# EAGLE schematic dat1 (EAGLE 6.1)

## Sheet 1 of 2
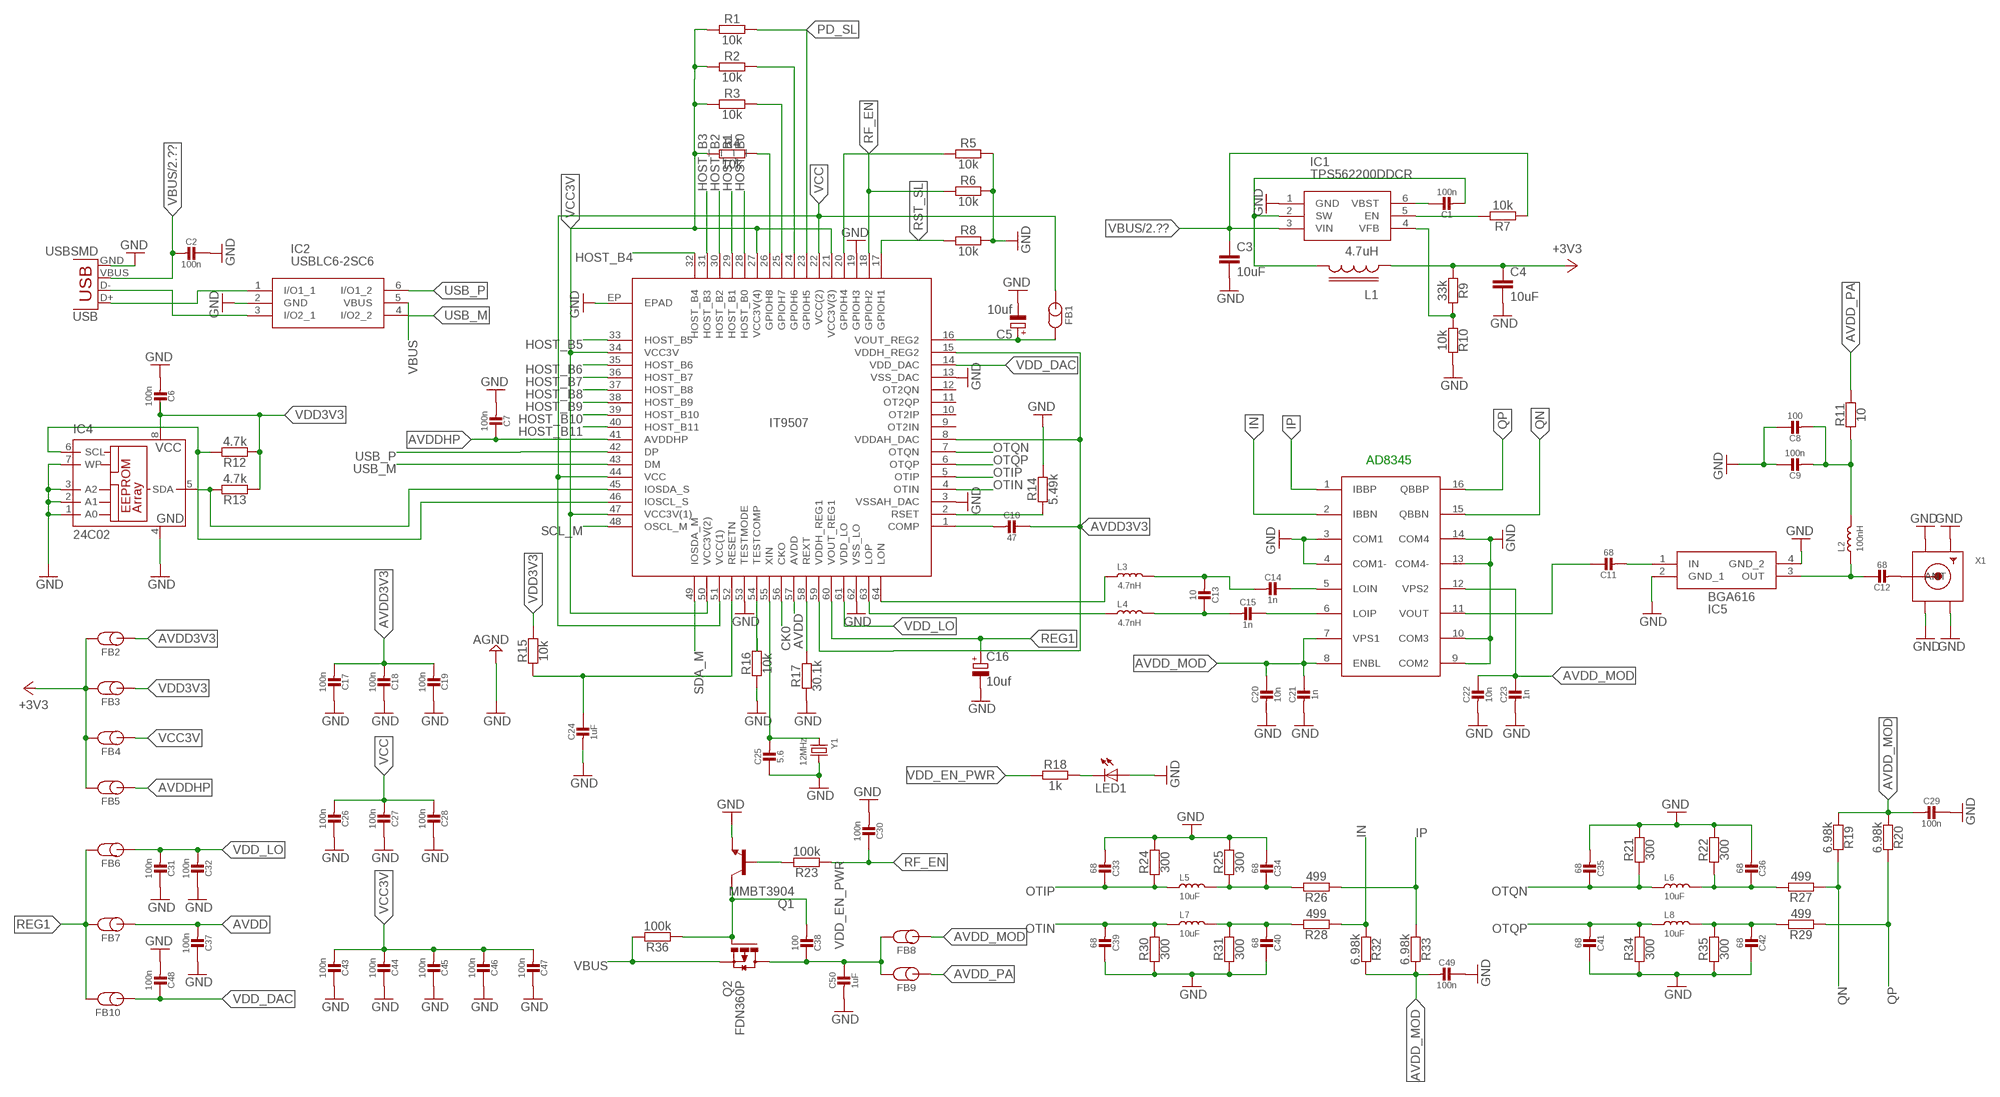
[diagram p0: schematic, sheet 1]

### Parts
C1  100n  CAP_CERAMIC_0402  [_0402]
C2  100n  CAP_CERAMIC_0402  [_0402]
C3  10uF  C-EUC0805K  [C0805K]
C4  10uF  C-EUC0805K  [C0805K]
C5  10uf  CPOL-EUSMCA  [SMC_A]
C6  100n  CAP_CERAMIC_0402  [_0402]
C7  100n  CAP_CERAMIC_0402  [_0402]
C8  100  CAP_CERAMIC_0402  [_0402]
C9  100n  CAP_CERAMIC_0402  [_0402]
C10  47  CAP_CERAMIC_0402  [_0402]
C11  68  CAP_CERAMIC_0402  [_0402]
C12  68  CAP_CERAMIC_0402  [_0402]
C13  10  CAP_CERAMIC_0402  [_0402]
C14  1n  CAP_CERAMIC_0402  [_0402]
C15  1n  CAP_CERAMIC_0402  [_0402]
C16  10uf  CPOL-EUSMCA  [SMC_A]
C17  100n  CAP_CERAMIC_0402  [_0402]
C18  100n  CAP_CERAMIC_0402  [_0402]
C19  100n  CAP_CERAMIC_0402  [_0402]
C20  10n  CAP_CERAMIC_0402  [_0402]
C21  1n  CAP_CERAMIC_0402  [_0402]
C22  10n  CAP_CERAMIC_0402  [_0402]
C23  1n  CAP_CERAMIC_0402  [_0402]
C24  1uF  CAP_CERAMIC_0402  [_0402]
C25  5.6  CAP_CERAMIC_0402  [_0402]
C26  100n  CAP_CERAMIC_0402  [_0402]
C27  100n  CAP_CERAMIC_0402  [_0402]
C28  100n  CAP_CERAMIC_0402  [_0402]
C29  100n  CAP_CERAMIC_0402  [_0402]
C30  100n  CAP_CERAMIC_0402  [_0402]
C31  100n  CAP_CERAMIC_0402  [_0402]
C32  100n  CAP_CERAMIC_0402  [_0402]
C33  68  CAP_CERAMIC_0402  [_0402]
C34  68  CAP_CERAMIC_0402  [_0402]
C35  68  CAP_CERAMIC_0402  [_0402]
C36  68  CAP_CERAMIC_0402  [_0402]
C37  100n  CAP_CERAMIC_0402  [_0402]
C38  100  CAP_CERAMIC_0402  [_0402]
C39  68  CAP_CERAMIC_0402  [_0402]
C40  68  CAP_CERAMIC_0402  [_0402]
C41  68  CAP_CERAMIC_0402  [_0402]
C42  68  CAP_CERAMIC_0402  [_0402]
C43  100n  CAP_CERAMIC_0402  [_0402]
C44  100n  CAP_CERAMIC_0402  [_0402]
C45  100n  CAP_CERAMIC_0402  [_0402]
C46  100n  CAP_CERAMIC_0402  [_0402]
C47  100n  CAP_CERAMIC_0402  [_0402]
C48  100n  CAP_CERAMIC_0402  [_0402]
C49  100n  CAP_CERAMIC_0402  [_0402]
C50  1uF  CAP_CERAMIC_0603  [_0603]
FB1  FB0603  [INDC1608X95N]
FB2  FB0603  [INDC1608X95N]
FB3  FB0603  [INDC1608X95N]
FB4  FB0603  [INDC1608X95N]
FB5  FB0603  [INDC1608X95N]
FB6  FB0603  [INDC1608X95N]
FB7  FB0603  [INDC1608X95N]
FB8  FB0603  [INDC1608X95N]
FB9  FB0603  [INDC1608X95N]
FB10  FB0603  [INDC1608X95N]
IC1  TPS562200DDCR  [SOT95P280X110-6N]
IC2  USBLC6-2SC6  [SOT95P280X145-6N]
IC3  CRYSTALVIDEO_IT9518  [CRYSTALVIDEO_QFN64P40_IT9518]
IC4  24C02  24C01ASN  [SO-08]
IC5  BGA616  [BGA616]
IC6  AD8346  [QSOP16]
L1  4.7uH  L3X3  [L_3X3]
L2  100nH  INDUCTOR/FERRITE-BEAD-0603  [L0603@1]
L3  4.7nH  INDUCTOR/FERRITE-BEAD-0603  [L0603@1]
L4  4.7nH  INDUCTOR/FERRITE-BEAD-0603  [L0603@1]
L5  10uF  INDUCTOR/FERRITE-BEAD-0805  [L0805@1]
L6  10uF  INDUCTOR/FERRITE-BEAD-0805  [L0805@1]
L7  10uF  INDUCTOR/FERRITE-BEAD-0805  [L0805@1]
L8  10uF  INDUCTOR/FERRITE-BEAD-0805  [L0805@1]
LED1  POWER  LEDCHIPLED-0603-TTW  [CHIPLED-0603-TTW]
Q1  MMBT3904  MMBT3904LT1-NPN-SOT23-BEC  [SOT23-BEC]
Q2  FDN360P  [SUPER-SOT3]
R1  10k  RESISTORS-0402  [C0402]
R2  10k  RESISTORS-0402  [C0402]
R3  10k  RESISTORS-0402  [C0402]
R4  10k  RESISTORS-0402  [C0402]
R5  10k  RESISTORS-0402  [C0402]
R6  10k  RESISTORS-0402  [C0402]
R7  10k  RESISTORS-0402  [C0402]
R8  10k  RESISTORS-0402  [C0402]
R9  33k  RESISTORS-0402  [C0402]
R10  10k  RESISTORS-0402  [C0402]
R11  10  RESISTORS-0603  [C0603]
R12  4.7k  RESISTORS-0402  [C0402]
R13  4.7k  RESISTORS-0402  [C0402]
R14  5.49k  RESISTORS-0402  [C0402]
R15  10k  RESISTORS-0402  [C0402]
R16  10k  RESISTORS-0402  [C0402]
R17  30.1k  RESISTORS-0402  [C0402]
R18  1k  RESISTORS-0402  [C0402]
R19  6.98k  RESISTORS-0402  [C0402]
R20  6.98k  RESISTORS-0402  [C0402]
R21  300  RESISTORS-0402  [C0402]
R22  300  RESISTORS-0402  [C0402]
R23  100k  RESISTORS-0603  [C0603]
R24  300  RESISTORS-0402  [C0402]
R25  300  RESISTORS-0402  [C0402]
R26  499  RESISTORS-0402  [C0402]
R27  499  RESISTORS-0402  [C0402]
R28  499  RESISTORS-0402  [C0402]
R29  499  RESISTORS-0402  [C0402]
R30  300  RESISTORS-0402  [C0402]
R31  300  RESISTORS-0402  [C0402]
R32  6.98k  RESISTORS-0402  [C0402]
R33  6.98k  RESISTORS-0402  [C0402]
R34  300  RESISTORS-0402  [C0402]
R35  300  RESISTORS-0402  [C0402]
R36  100k  RESISTORS-0603  [C0603]
USB  USBSMD  [USB-MINIB]
X1  MODULATOR_MICROBUILDER_SMACONNECTOR_EDGE_UFL  [MODULATOR_MICROBUILDER_SMA_EDGELAUNCH_UFL]
Y1  12MHz  CRYSTAL3.2X2.5  [CRYSTAL_3.2X2.5]

### Nets
+3V3: C4.1 FB2.2 FB3.2 FB4.2 FB5.2 L1.1 R9.1
AVDD: C37.2 FB7.1 IC3.57(AVDD)
AVDD3V3: C10.1 C17.2 C18.2 C19.2 FB2.1 IC3.8(VDDAH_DAC) IC3.15(VDDH_REG2) IC3.59(VDDH_REG1)
AVDD_MOD: C20.1 C21.1 C22.1 C23.1 C29.2 C49.2 FB8.1 IC6.7(VPS1) IC6.8(ENBL) IC6.12(VPS2) R19.1 R20.1 R32.2 R33.2
AVDD_PA: FB9.1 R11.2
AVDDHP: C7.1 FB5.1 IC3.41(AVDDHP)
CK0: IC3.56(CKO) ; also sheet 2
GND: C2.1 C3.2 C4.2 C5.- C6.2 C7.2 C8.1 C9.1 C16.- C17.1 C18.1 C19.1 C20.2 C21.2 C22.2 C23.2 C24.2 C25.1 C26.1 C27.1 C28.1 C29.1 C30.2 C31.1 C32.1 C33.2 C34.2 C35.2 C36.2 C37.1 C39.1 C40.1 C41.1 C42.1 C43.1 C44.1 C45.1 C46.1 C47.1 C48.2 C49.1 C50.2 IC1.1(GND) IC2.2(GND) IC3.3(VSSAH_DAC) IC3.13(VSS_DAC) IC3.19(GPIOH3) IC3.53(TESTMODE) IC3.62(VSS_LO) IC3.EP(EPAD) IC4.1(A0) IC4.2(A1) IC4.3(A2) IC4.4(GND) IC4.7(WP) IC5.2(GND_1) IC5.4(GND_2) IC6.3(COM1) IC6.4(COM1-) IC6.9(COM2) IC6.10(COM3) IC6.13(COM4-) IC6.14(COM4) LED1.A@1(A) Q1.E R5.2 R6.2 R8.2 R10.2 R14.2 R16.1 R17.1 R21.2 R22.2 R24.2 R25.2 R30.1 R31.1 R34.1 R35.1 USB.GND X1.GND@1(GND1) X1.GND@2(GND2) X1.GND@3(GND3) X1.GND@4(GND4) Y1.2 ; also sheet 2
HOST_B0: IC3.28(HOST_B0) ; also sheet 2
HOST_B1: IC3.29(HOST_B1) ; also sheet 2
HOST_B2: IC3.30(HOST_B2) ; also sheet 2
HOST_B3: IC3.31(HOST_B3) ; also sheet 2
HOST_B4: IC3.32(HOST_B4) ; also sheet 2
HOST_B5: IC3.33(HOST_B5) ; also sheet 2
HOST_B6: IC3.35(HOST_B6) ; also sheet 2
HOST_B7: IC3.36(HOST_B7) ; also sheet 2
HOST_B8: IC3.37(HOST_B8) ; also sheet 2
HOST_B9: IC3.38(HOST_B9) ; also sheet 2
HOST_B10: IC3.39(HOST_B10) ; also sheet 2
HOST_B11: IC3.40(HOST_B11) ; also sheet 2
IN: IC6.2(IBBN) R28.1 R32.1
IP: IC6.1(IBBP) R26.1 R33.1
N$2: C1.2 IC1.2(SW) L1.2
N$3: C25.2 IC3.55(XIN) Y1.1
N$4: IC3.26(GPIOH8) R4.2
N$5: IC3.54(TESTCOMP) R16.2
N$6: C24.1 IC3.52(RESETN) R15.1
N$8: IC2.3(I/O2_1) USB.D-
N$9: C1.1 IC1.6(VBST)
N$10: C5.+ FB1.2 IC3.16(VOUT_REG2)
N$11: IC3.58(REXT) R17.2
N$12: IC3.45(IOSDA_S) IC4.5(SDA) R13.2
N$13: IC3.46(IOSCL_S) IC4.6(SCL) R12.2
N$14: IC3.64(LON) L3.1
N$15: IC3.63(LOP) L4.1
N$16: IC1.5(EN) R7.2
N$17: C12.2 X1.P(ANT)
N$18: C8.2 C9.2 L2.2 R11.1
N$19: C15.1 IC6.6(LOIP)
N$20: LED1.C@1(C) R18.2
N$21: C11.1 IC6.11(VOUT)
N$22: IC2.1(I/O1_1) USB.D+
N$23: IC1.4(VFB) R9.2 R10.1
N$24: C14.1 IC6.5(LOIN)
N$25: C13.1 C15.2 L4.2
N$26: C13.2 C14.2 L3.2
N$27: C36.1 L6.2 R22.1 R27.2
N$28: C42.2 L8.2 R29.2 R35.2
N$29: C34.1 L5.2 R25.1 R26.2
N$30: C40.2 L7.2 R28.2 R31.2
N$31: IC3.25(GPIOH7) R3.2
N$32: IC3.24(GPIOH6) R2.2
N$34: C10.2 IC3.1(COMP)
N$36: IC3.2(RSET) R14.1
N$37: C12.1 IC5.3(OUT) L2.1
N$38: C11.2 IC5.1(IN)
N$41: IC3.20(GPIOH4) R5.1
OTIN: C39.2 IC3.4(OTIN) L7.1 R30.2
OTIP: C33.1 IC3.5(OTIP) L5.1 R24.1
OTQN: C35.1 IC3.7(OTQN) L6.1 R21.1
OTQP: C41.2 IC3.6(OTQP) L8.1 R34.2
PD_SL: IC3.23(GPIOH5) R1.2 ; also sheet 2
Q1: Q1.B R23.2
QN: IC6.15(QBBN) R19.2 R27.1
QP: IC6.16(QBBP) R20.2 R29.1
REG1: C16.+ FB6.2 FB7.2 FB10.2 IC3.60(VOUT_REG1)
RF_EN: C30.1 IC3.18(GPIOH2) R6.1 R23.1
RST_SL: IC3.17(GPIOH1) R8.1 ; also sheet 2
SCL_M: IC3.48(OSCL_M) ; also sheet 2
SDA_M: IC3.49(IOSDA_M) ; also sheet 2
USB_M: IC2.4(I/O2_2) IC3.43(DM)
USB_P: IC2.6(I/O1_2) IC3.42(DP)
V: C38.2 Q1.C Q2.1(G) R36.1
VBUS: C2.2 C3.1 IC1.3(VIN) IC2.5(VBUS) Q2.2(S) R7.1 R36.2 USB.VBUS ; also sheet 2
VCC: C26.2 C27.2 C28.2 FB1.1 IC3.22(VCC(2)) IC3.44(VCC) IC3.51(VCC(1))
VCC3V: C43.2 C44.2 C45.2 C46.2 C47.2 FB4.1 IC3.21(VCC3V(3)) IC3.27(VCC3V(4)) IC3.34(VCC3V) IC3.47(VCC3V(1)) IC3.50(VCC3V(2)) R1.1 R2.1 R3.1 R4.1
VDD3V3: C6.1 FB3.1 IC4.8(VCC) R12.1 R13.1 R15.2
VDD_DAC: C48.1 FB10.1 IC3.14(VDD_DAC)
VDD_EN_PWR: C38.1 C50.1 FB8.2 FB9.2 Q2.3(D) R18.1
VDD_LO: C31.2 C32.2 FB6.1 IC3.61(VDD_LO)
Unconnected: IC3.9(OT2IN) IC3.10(OT2IP) IC3.11(OT2QP) IC3.12(OT2QN)

### Notes on the sheet
- AD8345

## Sheet 2 of 2
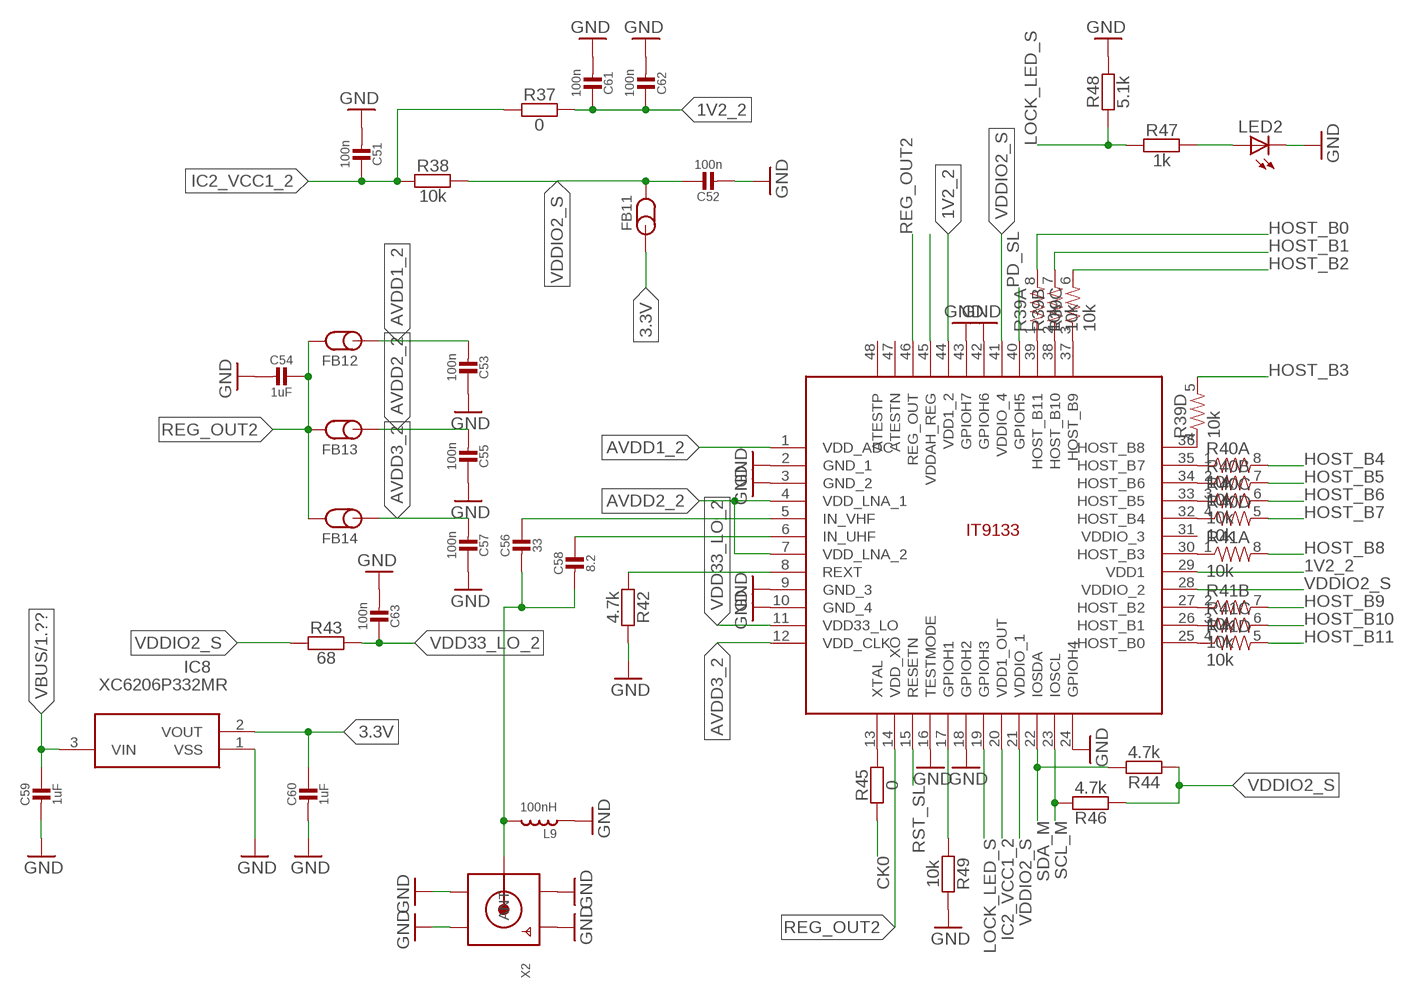
[diagram p1: schematic, sheet 2]

### Parts
C51  100n  CAP_CERAMIC_0402  [_0402]
C52  100n  CAP_CERAMIC_0402  [_0402]
C53  100n  CAP_CERAMIC_0402  [_0402]
C54  1uF  CAP_CERAMIC_0402  [_0402]
C55  100n  CAP_CERAMIC_0402  [_0402]
C56  33  CAP_CERAMIC_0402  [_0402]
C57  100n  CAP_CERAMIC_0402  [_0402]
C58  8.2  CAP_CERAMIC_0402  [_0402]
C59  1uF  CAP_CERAMIC_0603  [_0603]
C60  1uF  CAP_CERAMIC_0603  [_0603]
C61  100n  CAP_CERAMIC_0402  [_0402]
C62  100n  CAP_CERAMIC_0402  [_0402]
C63  100n  CAP_CERAMIC_0402  [_0402]
FB11  FB0603  [INDC1608X95N]
FB12  FB0603  [INDC1608X95N]
FB13  FB0603  [INDC1608X95N]
FB14  FB0603  [INDC1608X95N]
IC7  CRYSTALVIDEO_IT9133  [CRYSTALVIDEO_QFN48P50_IT9133]
IC8  XC6206P332MR  [SOT95P280X130-3N]
L9  100nH  INDUCTOR/FERRITE-BEAD-0603S  [L0603S]
LED2  POWER  LEDCHIPLED-0603-TTW  [CHIPLED-0603-TTW]
R37  0  RESISTORS-0402  [C0402]
R38  10k  RESISTORS-0402  [C0402]
R39  10k  RESISTOR-ARRAY0603-ARV  [0603-ARV]
R40  10k  RESISTOR-ARRAY0603-ARV  [0603-ARV]
R41  10k  RESISTOR-ARRAY0603-ARV  [0603-ARV]
R42  4.7k  RESISTORS-0402  [C0402]
R43  68  RESISTORS-0402  [C0402]
R44  4.7k  RESISTORS-0402  [C0402]
R45  0  RESISTORS-0402  [C0402]
R46  4.7k  RESISTORS-0402  [C0402]
R47  1k  RESISTORS-0402  [C0402]
R48  5.1k  RESISTORS-0402  [C0402]
R49  10k  RESISTORS-0402  [C0402]
X2  MODULATOR_MICROBUILDER_SMACONNECTOR_EDGE_UFL  [MODULATOR_MICROBUILDER_SMA_EDGELAUNCH_UFL]

### Nets
1V2_2: C61.1 C62.1 IC7.29(VDD1) IC7.44(VDD1_2) R37.2
3.3V: C60.1 FB11.1 IC8.2(VOUT)
AVDD1_2: C53.2 FB12.1 IC7.1(VDD_ADC)
AVDD2_2: C55.2 FB13.1 IC7.4(VDD_LNA_1) IC7.7(VDD_LNA_2)
AVDD3_2: C57.2 FB14.1 IC7.12(VDD_CLK)
CK0: R45.1 ; also sheet 1
GND: C51.2 C52.2 C53.1 C54.2 C55.1 C57.1 C59.2 C60.2 C61.2 C62.2 C63.2 IC7.2(GND_1) IC7.3(GND_2) IC7.9(GND_3) IC7.10(GND_4) IC7.16(TESTMODE) IC7.18(GPIOH2) IC7.24(GPIOH4) IC7.42(GPIOH6) IC7.43(GPIOH7) IC8.1(VSS) L9.1 LED2.C@1(C) R42.2 R48.2 R49.2 X2.GND@1(GND1) X2.GND@2(GND2) X2.GND@3(GND3) X2.GND@4(GND4) ; also sheet 1
HOST_B0: R39.8 ; also sheet 1
HOST_B1: R39.7 ; also sheet 1
HOST_B2: R39.6 ; also sheet 1
HOST_B3: R39.5 ; also sheet 1
HOST_B4: R40.8 ; also sheet 1
HOST_B5: R40.7 ; also sheet 1
HOST_B6: R40.6 ; also sheet 1
HOST_B7: R40.5 ; also sheet 1
HOST_B8: R41.8 ; also sheet 1
HOST_B9: R41.7 ; also sheet 1
HOST_B10: R41.6 ; also sheet 1
HOST_B11: R41.5 ; also sheet 1
IC2_VCC1_2: C51.1 IC7.20(VDD1_OUT) R37.1 R38.1
LOCK_LED_S: IC7.19(GPIOH3) R47.1 R48.1
N$7: IC7.13(XTAL) R45.2
N$33: IC7.45(VDDAH_REG)
N$35: C56.2 C58.2 L9.2 X2.P(ANT)
N$39: IC7.39(HOST_B11) R39.1
N$40: IC7.38(HOST_B10) R39.2
N$42: IC7.37(HOST_B9) R39.3
N$43: IC7.36(HOST_B8) R39.4
N$44: IC7.35(HOST_B7) R40.1
N$45: IC7.34(HOST_B6) R40.2
N$46: IC7.33(HOST_B5) R40.3
N$47: IC7.32(HOST_B4) R40.4
N$48: IC7.30(HOST_B3) R41.1
N$49: IC7.27(HOST_B2) R41.2
N$50: IC7.26(HOST_B1) R41.3
N$51: IC7.25(HOST_B0) R41.4
N$52: IC7.17(GPIOH1) R49.1
N$53: C56.1 IC7.5(IN_VHF)
N$54: C58.1 IC7.6(IN_UHF)
N$55: IC7.8(REXT) R42.1
N$56: LED2.A@1(A) R47.2
PD_SL: IC7.40(GPIOH5) ; also sheet 1
REG_OUT2: C54.1 FB12.2 FB13.2 FB14.2 IC7.14(VDD_XO) IC7.46(REG_OUT)
RST_SL: IC7.15(RESETN) ; also sheet 1
SCL_M: IC7.23(IOSCL) R46.2 ; also sheet 1
SDA_M: IC7.22(IOSDA) R44.2 ; also sheet 1
VBUS: C59.1 IC8.3(VIN) ; also sheet 1
VDD33_LO_2: C63.1 IC7.11(VDD33_LO) R43.2
VDDIO2_S: C52.1 FB11.2 IC7.21(VDDIO_1) IC7.28(VDDIO_2) IC7.41(VDDIO_4) R38.2 R43.1 R44.1 R46.1
Unconnected: IC7.31(VDDIO_3) IC7.47(ATESTN) IC7.48(ATESTP)

## Library data of the parts
C1 C2 C6-C15 C17-C63 = microbuilder:CAP_CERAMIC: Ceramic Capacitors For new designs, use the packages preceded by an '_' character since they are more reliable: The following footprints should be used on most boards: _0402 - Standard footprint for regular board layouts _0603 - Standard footprint for regular board layouts _0805 - Standard footprint for regular board layouts _1206 - Standard footprint for regular board layouts For extremely tight-pitch boards where space is at a premium, the following 'micro-pitch' footprints can be used (smaller pads, no silkscreen outline, etc.): _0402MP - Micro-pitch footprint for very dense/compact boards _0603MP - Micro-pitch footprint for very dense/compact boards _0805MP - Micro-pitch footprint for very dense/compact boards _1206MP - Micro-pitch footprint for very dense/compact boards
C3 C4 = SmartPrj:C-EU: CAPACITOR, European symbol
C5 C16 = rcl:CPOL-EU: POLARIZED CAPACITOR, European symbol
FB1-FB14 = adf4350-breakout:FB
IC1 = SamacSys_Parts:TPS562200DDCR: 17 V Input, 2A Synchronous Step-Down Regulator in SOT-23 with Advanced Eco-mode™ Source: Datasheet <http://www.ti.com/lit/gpn/tps562200>; ARROW_PART_NUMBER: TPS562200DDCR; ARROW_PRICE-STOCK: https://www.arrow.com/en/products/tps562200ddcr/texas-instruments?region=nac; DESCRIPTION: 17 V Input, 2A Synchronous Step-Down Regulator in SOT-23 with Advanced Eco-mode&#153;; HEIGHT: 1.1mm; MANUFACTURER_NAME: Texas Instruments; MANUFACTURER_PART_NUMBER: TPS562200DDCR; MOUSER_PART_NUMBER: 595-TPS562200DDCR; MOUSER_PRICE-STOCK: https://www.mouser.co.uk/ProductDetail/Texas-Instruments/TPS562200DDCR?qs=7wMBv%2Ftbz9Jdis0htpD4wA%3D%3D
IC2 = SamacSys_Parts:USBLC6-2SC6: TVS Diode Array Uni-Directional USBLC6-2SC6 17V, SOT-23 6-Pin Source: Datasheet <http://www.st.com/st-web-ui/static/active/en/resource/technical/document/datasheet/CD00050750.pdf>; ARROW_PART_NUMBER: USBLC6-2SC6; ARROW_PRICE-STOCK: https://www.arrow.com/en/products/usblc6-2sc6/stmicroelectronics; DESCRIPTION: TVS Diode Array Uni-Directional USBLC6-2SC6 17V, SOT-23 6-Pin; HEIGHT: 1.45mm; MANUFACTURER_NAME: STMicroelectronics; MANUFACTURER_PART_NUMBER: USBLC6-2SC6; MOUSER_PART_NUMBER: 511-USBLC6-2SC6; MOUSER_PRICE-STOCK: https://www.mouser.co.uk/ProductDetail/STMicroelectronics/USBLC6-2SC6/?qs=po45yt2pPpu%2FhNIlwQdTlg%3D%3D
IC3 = dat:CRYSTALVIDEO_IT9518: ITE IT9518 MFQN 64 pin package COFDM SOC modulator
IC4 = microchip:24C*: Serial EEPROM 1 K/2 K/4 K; MPN: AT24C01BN-SH-B; OC_FARNELL: 1362638; OC_NEWARK: 50M3313
IC5 = BGA616:BGA616: Infineon BGA616, RF Amplifier, 18 dB 6 GHz, 4-Pin SOT-343 Source: Datasheet <https://www.infineon.com/dgdl/Infineon-BGA616-DS-v02_01-en.pdf?fileId=db3a304314dca3890115419102bb163b>; DESCRIPTION: Infineon BGA616, RF Amplifier, 18 dB 6 GHz, 4-Pin SOT-343; HEIGHT: 1mm; MANUFACTURER_NAME: Infineon; MANUFACTURER_PART_NUMBER: BGA616
IC6 = mano:AD8346
IC7 = dat:CRYSTALVIDEO_IT9133: ITE IT9133 COFDM Demodulation SOC
IC8 = SamacSys_Parts:XC6206P332MR: Low ESR Cap.Compatible Postive Voltage Regulators Source: Datasheet <http://www.torexsemi.com/products/voltage_regulators/data/XC6206.pdf>; ARROW_PART_NUMBER: XC6206P332MR; DESCRIPTION: Low ESR Cap.Compatible Postive Voltage Regulators; HEIGHT: 1.3mm; MANUFACTURER_NAME: Torex; MANUFACTURER_PART_NUMBER: XC6206P332MR
L1 = additional:L: Inductor
L2-L9 = Discrete:INDUCTOR/FERRITE-BEAD
LED1 LED2 = led:LED: LED OSRAM: - CHIPLED LG R971, LG N971, LY N971, LG Q971, LY Q971, LO R971, LY R971 LH N974, LH R974 LS Q976, LO Q976, LY Q976 LO Q996 - Hyper CHIPLED LW Q18S LB Q993, LB Q99A, LB R99A - SideLED LS A670, LO A670, LY A670, LG A670, LP A670 LB A673, LV A673, LT A673, LW A673 LH A674 LY A675 LS A676, LA A676, LO A676, LY A676, LW A676 LS A679, LY A679, LG A679 - Hyper Micro SIDELED® LS Y876, LA Y876, LO Y876, LY Y876 LT Y87S - SmartLED LW L88C, LW L88S LB L89C, LB L89S, LG L890 LS L89K, LO L89K, LY L89K LS L896, LA L896, LO L896, LY L896 - TOPLED LS T670, LO T670, LY T670, LG T670, LP T670 LSG T670, LSP T670, LSY T670, LOP T670, LYG T670 LG T671, LOG T671, LSG T671 LB T673, LV T673, LT T673, LW T673 LH T674 LS T676, LA T676, LO T676, LY T676, LB T676, LH T676, LSB T676, LW T676 LB T67C, LV T67C, LT T67C, LS T67K, LO T67K, LY T67K, LW E67C LS E67B, LA E67B, LO E67B, LY E67B, LB E67C, LV E67C, LT E67C LW T67C LS T679, LY T679, LG T679 LS T770, LO T770, LY T770, LG T770, LP T770 LB T773, LV T773, LT T773, LW T773 LH T774 LS E675, LA E675, LY E675, LS T675 LS T776, LA T776, LO T776, LY T776, LB T776 LHGB T686 LT T68C, LB T68C - Hyper Mini TOPLED® LB M676 - Mini TOPLED Santana® LG M470 LS M47K, LO M47K, LY M47K Source: http://www.osram.convergy.de LUXEON: - LUMILED® LXK2-PW12-R00, LXK2-PW12-S00, LXK2-PW14-U00, LXK2-PW14-V00 LXK2-PM12-R00, LXK2-PM12-S00, LXK2-PM14-U00 LXK2-PE12-Q00, LXK2-PE12-R00, LXK2-PE12-S00, LXK2-PE14-T00, LXK2-PE14-U00 LXK2-PB12-K00, LXK2-PB12-L00, LXK2-PB12-M00, LXK2-PB14-N00, LXK2-PB14-P00, LXK2-PB14-Q00 LXK2-PR12-L00, LXK2-PR12-M00, LXK2-PR14-Q00, LXK2-PR14-R00 LXK2-PD12-Q00, LXK2-PD12-R00, LXK2-PD12-S00 LXK2-PH12-R00, LXK2-PH12-S00 LXK2-PL12-P00, LXK2-PL12-Q00, LXK2-PL12-R00 Source: www.luxeon.com KINGBRIGHT: KA-3528ASYC Source: www.kingbright.com
Q1 = transistor:*-NPN-: NPN Transistror BF959 corrected 2008.03.06
Q2 = transistor-power:FDN360P: Single P-Channel, PowerTrench (R) MOSFET Source: http://www.fairchildsemi.com/ds/FD/FDN360P.pdf
R1-R38 R42-R49 = Arduino:RESISTORS: Resistors all kinds in 0603 and 0402
R39-R41 = SparkFun-Passives:RESISTOR-ARRAY: Array Chip Resistor Source: RS Component / Phycomp
USB = SparkFun-Connectors:USB: USB Connectors USB-B-PTH is fully proven SKU : PRT-00139/CONN-08278 USB-miniB is fully proven SKU : PRT-00587 USB-A-PCB is untested. USB-A-H is throughly reviewed, but untested. Spark Fun Electronics SKU : PRT-00437 USB-B-SMT is throughly reviewed, but untested. Needs silkscreen touching up. USB-A-S has not been used/tested USB-MB-H has not been used/tested USB-MICROB has been used. CONN-09505; PROD_ID: CONN-08193
X1 X2 = dat:MODULATOR_MICROBUILDER_SMACONNECTOR: SMA Connector 90° DIP SMA Connector, 50 Ohm (4UConnector: 07259)
Y1 = microbuilder:CRYSTAL: Crystals HC49UP - Surface Mount Crystal 4.0MHz 18pF +/-30ppm Surface Mount Crystal [Digikey: 535-9857-1-ND] 12.0 MHz Surface Mount Crystal [Digikey: 535-9869-6-ND] 25.0 MHz Surface Mount Crystal [Digikey: 535-9078-1-ND] 2.5 x 2.0mm - MEMs SMT Crystal 16.0 MHz 10pF 20ppm 2.5 x 2.0mm Crystal [Digikey -40-85°C: 535-10923-1-ND] 3.2 x 2.5mm - MEMs SMT Crystal 12.0 MHz 8pF 15ppm 3.2 x 2.5mm Crystal [Digikey: -10-70°C: 644-1047-1-ND -40-125°C: 644-1128-1-ND] 40~85°C cheaper: 644-1173-6-ND 16.0 MHz 8pF 15ppm 3.2 x 2.5mm Crystal [Digikey: -10-70°C: 644-1049-1-ND -40-125°C: 644-1129-2-ND]-40~85°C cheaper: 644-1175-6-ND 16.0 MHz 10pF 10ppm 3.2 x 2.5mm Crystal [Digikey: 644-1100-1-ND] 27.12 MHz 18pF 30ppm 3.2 x 2.5mm Crystal [Digikey: 887-1424-1-ND] 27.12MHz 10pF 10ppm 3.2 x 2.5mm Crystal [Digikey: 887-1329-1-ND] 4.9 x 1.8mm - MEMs SMT Crystal 32.768 KHz 12.5pF 20ppm 4.9 x 1.8mm Crystal [Digikey: SE2415CT-ND] 8.0 x 3.8mm - Surface Mount Crystal 32.768kHz 12.5pF 20ppm -40°C-85°C [Digikey: 535-9166-2-ND] Cylinder 32.768KHz Cylinder Crystal (2x6mm body) [Ex. Digikey: 300-8341-2-ND]

## Net classes
1 USB: width 0.406 mm
2 gnd: width 0.254 mm, drill 0.584 mm, clearance 0.203 mm